# Altium schematic sheet cc2538.SchDoc: Edison Gateway - CC2538
size Letter; Author: Ye-Sheng Kuo; DocumentNumber: 8; Revision: 3; SheetNumber: 8; SheetTotal: 10
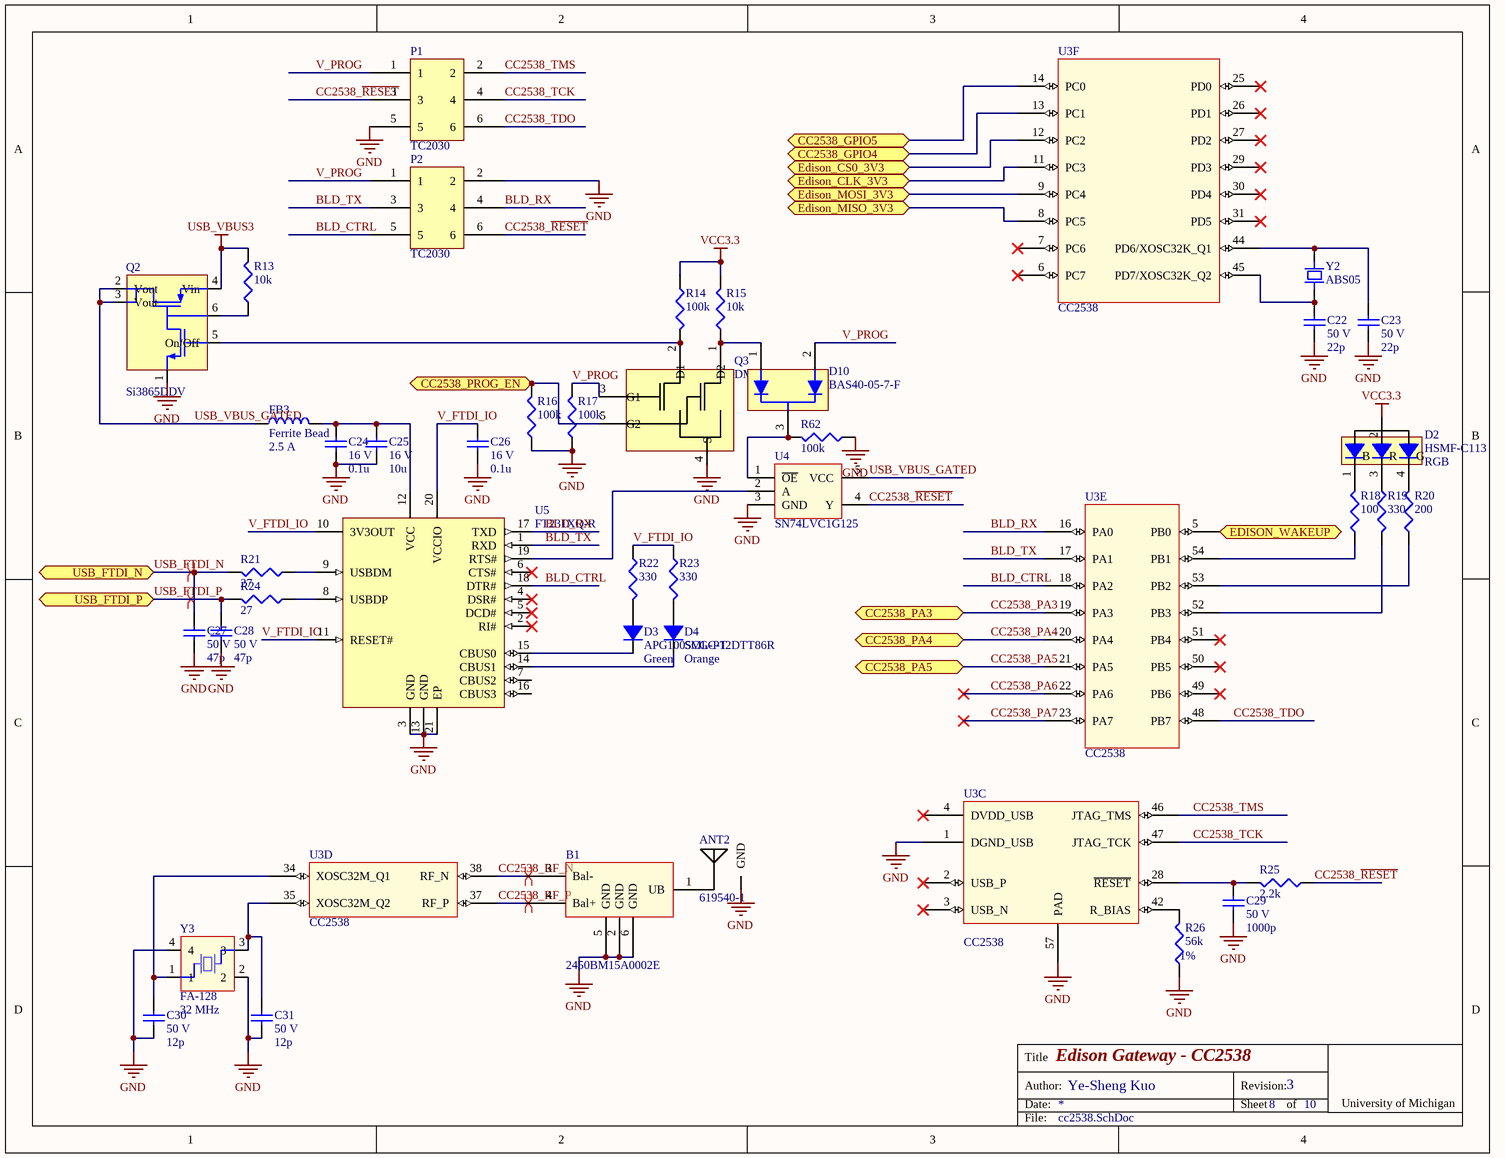
[diagram p0: cc2538.SchDoc]

## Parts
ANT2  619540-1  [619540-1]
B1  2450BM15A0002E  [2450BM15A0002]
C22  voltage rated: 50 V  [0402]  (hidden comment: 22p)
C23  voltage rated: 50 V  [0402]  (hidden comment: 22p)
C24  voltage rated: 16 V  [0402]  (hidden comment: 0.1u)
C25  voltage rated: 16 V  [0603]  (hidden comment: 10u)
C26  voltage rated: 16 V  [0402]  (hidden comment: 0.1u)
C27  voltage rated: 50 V  [0402]  (hidden comment: 47p)
C28  voltage rated: 50 V  [0402]  (hidden comment: 47p)
C29  voltage rated: 50 V  [0402]  (hidden comment: 1000p)
C30  voltage rated: 50 V  [0402]  (hidden comment: 12p)
C31  voltage rated: 50 V  [0402]  (hidden comment: 12p)
D2  HSMF-C113  value RGB  [HSMF]
D3  APG1005CGC-T  value Green  [0402 - LED]
D4  SML-P12DTT86R  value Orange  [0402 - LED]
D10  BAS40-05-7-F  [SOT23-3]
FB3  Ferrite Bead  Current Rating (Max): 2.5 A  [0603]
P1  TC2030  [TC2030-IDC-NLFP]
P2  TC2030  [TC2030-IDC-NLFP]
Q2  Si3865DDV  [TSOT-23]
Q3  DMN32D2LDF  [SOT-353-5]
R13  10k  [0402]
R14  100k  [0402]
R15  10k  [0402]
R16  100k  [0402]
R17  100k  [0402]
R18  100  [0402]
R19  330  [0402]
R20  200  [0402]
R21  27  [0402]
R22  330  [0402]
R23  330  [0402]
R24  27  [0402]
R25  2.2k  [0402]
R26  Tolerance: 1%  [0402]  (hidden comment: 56k)
R62  100k  [0402]
U3  CC2538  [QFN56]  (parts C,D,E,F of 6)
U4  SN74LVC1G125  [SOT23-5]
U5  FT231XQ-R  [QFN-20_N]
Y2  ABS05  [ABS05]
Y3  FA-128  frequency: 32 MHz  [FA-128]

## Ports
CC2538_GPIO4, CC2538_GPIO5, CC2538_PA3, CC2538_PA4, CC2538_PA5, CC2538_PROG_EN, Edison_CLK_3V3, Edison_CS0_3V3, Edison_MISO_3V3, Edison_MOSI_3V3, EDISON_WAKEUP, USB_FTDI_N, USB_FTDI_P

## Nets
GND: ANT2.1(GND) B1.2(GND) B1.5(GND) B1.6(GND) C22.2 C23.2 C24.2 C25.2 C26.2 C27.1 C28.1 C29.2 C30.1 C31.1 P1.5 P2.2 Q2.1 Q3.4(S) R16.2 R17.2 R26.2 R62.2 U3.1(DGND_USB) U3.57(PAD) U4.3(GND) U5.3(GND) U5.13(GND) U5.21(EP) Y3.2 Y3.4
USB_VBUS3: Q2.4(Vin) R13.1
VCC3.3: D2.2 R14.1 R15.1
BLD_CTRL: P2.5 U3.18(PA2) U5.18(DTR#)
BLD_RX: P2.4 U3.16(PA0) U5.17(TXD)
BLD_TX: P2.3 U3.17(PA1) U5.1(RXD)
CC2538_GPIO4: U3.13(PC1) ; port CC2538_GPIO4
CC2538_GPIO5: U3.14(PC0) ; port CC2538_GPIO5
CC2538_PA3: U3.19(PA3) ; port CC2538_PA3
CC2538_PA4: U3.20(PA4) ; port CC2538_PA4
CC2538_PA5: U3.21(PA5) ; port CC2538_PA5
CC2538_PA6: U3.22(PA6)
CC2538_PA7: U3.23(PA7)
CC2538_PROG_EN: Q3.5(G2) R16.1 ; port CC2538_PROG_EN
CC2538_~{RESET}: P1.3 P2.6 R25.2 U4.4(Y)
CC2538_RF_N: B1.3(Bal-) U3.38(RF_N)
CC2538_RF_P: B1.4(Bal+) U3.37(RF_P)
CC2538_TCK: P1.4 U3.47(JTAG_TCK)
CC2538_TDO: P1.6 U3.48(PB7)
CC2538_TMS: P1.2 U3.46(JTAG_TMS)
Edison_CLK_3V3: U3.11(PC3) ; port Edison_CLK_3V3
Edison_CS0_3V3: U3.12(PC2) ; port Edison_CS0_3V3
Edison_MISO_3V3: U3.8(PC5) ; port Edison_MISO_3V3
Edison_MOSI_3V3: U3.9(PC4) ; port Edison_MOSI_3V3
EDISON_WAKEUP: U3.5(PB0) ; port EDISON_WAKEUP
USB_FTDI_N: C27.2 R21.1 ; port USB_FTDI_N
USB_FTDI_P: C28.2 R24.1 ; port USB_FTDI_P
USB_VBUS_GATED: FB3.2 Q2.2(Vout) Q2.3(Vout) U4.5(VCC)
V_FTDI_IO: C26.1 R22.2 R23.2 U5.10(3V3OUT) U5.11(RESET#) U5.20(VCCIO)
V_PROG: D10.2 P1.1 P2.1 Q3.3(G1) R17.1
NetANT2_2: ANT2.2 B1.1(UB)
NetC22_1: C22.1 U3.45(PD7/XOSC32K_Q2) Y2.2
NetC23_1: C23.1 U3.44(PD6/XOSC32K_Q1) Y2.1
NetC24_1: C24.1 C25.1 FB3.1 U5.12(VCC)
NetC29_1: C29.1 R25.1 U3.28(~{RESET})
NetC30_2: C30.2 U3.34(XOSC32M_Q1) Y3.1
NetC31_2: C31.2 U3.35(XOSC32M_Q2) Y3.3
NetD2_1: D2.1 R18.1
NetD2_3: D2.3 R19.2
NetD2_4: D2.4 R20.1
NetD3_1: D3.1 R22.1
NetD3_2: D3.2 U5.15(CBUS0)
NetD4_1: D4.1 R23.1
NetD4_2: D4.2 U5.14(CBUS1)
NetD10_1: D10.1 Q3.1(D2) R15.2
NetD10_3: D10.3 R62.1 U4.1(~{OE})
NetQ2_5: Q2.5(On/Off) Q3.2(D1) R14.2
NetQ2_6: Q2.6 R13.2
NetR18_2: R18.2 U3.54(PB1)
NetR19_1: R19.1 U3.52(PB3)
NetR20_2: R20.2 U3.53(PB2)
NetR21_2: R21.2 U5.9(USBDM)
NetR24_2: R24.2 U5.8(USBDP)
NetR26_1: R26.1 U3.42(R_BIAS)
NetU4_2: U4.2(A) U5.19(RTS#)

Not connected (* = marked no-connect by the designer): U3 2(USB_P)* 3(USB_N)* 4(DVDD_USB)* 6(PC7)* 7(PC6)* 25(PD0)* 26(PD1)* 27(PD2)* 29(PD3)* 30(PD4)* 31(PD5)* 49(PB6)* 50(PB5)* 51(PB4)*; U5 2(RI#)* 4(DSR#)* 5(DCD#)* 6(CTS#)* 7(CBUS2) 16(CBUS3)

## Layout directives
differential pair: CC2538_RF_N, CC2538_RF_P, USB_FTDI_N, USB_FTDI_P

## Notes on the sheet
- Title
- Date:
- Author:
- Revision:
- Sheet
- of
- University of Michigan
- File:
- (in symbol HSMF-C113) B; R; G

## Library data of the parts
ANT2 = 619540-1: CONN SMA JACK; Supplier 1: Digi-Key; Supplier Part Number 1: A120734-ND
B1 = 2450BM15A0002E: 2.45 GHz Balun for TI CC253X; Supplier 1: Digi-Key; Supplier Part Number 1: 712-1536-1-ND
C22 C23 = 500R07S220GV4T: 22pF ±2% 50V Ceramic Capacitor C0G, NP0 0402; Manufacture: Johanson Technology Inc.; Note: RF application; tolerance: 2%; package: 0402; Supplier 1: Digi-Key; Supplier Part Number 1: 712-1274-1-ND; Value: 22p; Temperature Coefficient: C0G, NP0; Manufacturer Part Number: 500R07S220GV4T
C24 C26 = GRM155R71C104KA88D: 0.10µF ±10% 16V Ceramic Capacitor X7R 0402; Manufacture: Murata; tolerance: 10%; package: 0402; Supplier 1: Digi-Key; Supplier Part Number 1: 490-3261-1-ND; Value: 0.1u; Temperature Coefficient: X7R; Manufacturer Part Number: GRM155R71C104KA88D
C25 = GRM188C81C106MA73D: 10µF ±20% 16V Ceramic Capacitor X6S 0603; Manufacture: Murata; tolerance: 20%; package: 0603; Temperature Coefficient: X6S; Supplier 1: Digi-Key; Supplier Part Number 1: 490-7198-1-ND; Value: 10u; Manufacturer Part Number: GRM188C81C106MA73D
C27 C28 = 500R07N470JV4T: 47pF ±5% 50V Ceramic Capacitor C0G, NP0 0402; Manufacture: Johanson Dielectrics Inc.; tolerance: 5%; package: 0402; Supplier 1: Digi-Key; Supplier Part Number 1: 709-1121-1-ND; Value: 47p; Temperature Coefficient: C0G, NP0; Manufacturer Part Number: 500R07N470JV4T
C29 = C1005C0G1H102J050BA: 1000pF ±5% 50V Ceramic Capacitor C0G, NP0 0402; Manufacture: TDK; tolerance: 5%; package: 0402; Supplier 1: Digi-Key; Supplier Part Number 1: 445-6846-1-ND; Value: 1000p; Temperature Coefficient: C0G, NP0; Manufacturer Part Number: C1005C0G1H102J050BA
C30 C31 = 500R07S120GV4T: 12pF ±2% 50V Ceramic Capacitor C0G, NP0 0402; Manufacture: Johanson Technology Inc.; Note: RF application; tolerance: 2%; package: 0402; Supplier 1: Digi-Key; Supplier Part Number 1: 712-1256-1-ND; Value: 12p; Temperature Coefficient: C0G, NP0; Manufacturer Part Number: 500R07S120GV4T
D2 = HSMF-C113: Red, Green, Blue (RGB) 626nm Red, 572nm Green, 470nm Blue LED Indication - Discrete 1.9V Red, 2V Green, 3.4V Blue 4-SMD; Manufacturer: Broadcom Limited; Supplier 1: Digi-Key; Supplier Part Number 1: 516-2232-1-ND; Manufacturer Part Number: HSMF-C113; Wavelength: 626nm Red, 572nm Green, 470nm Blue
D3 = APG1005CGC-T: Green 571nm LED Indication - Discrete 2V 0402 (1005 Metric); Manufacturer: Kingbright; Current @ VF: 20 mA; package: 0402; Forward Voltage: 2 V; Manufacturer Part Number: APG1005CGC-T; Wavelength: 571 nm; Supplier 1: Digi-Key; Supplier Part Number 1: 754-1811-1-ND
D4 = SML-P12DTT86R: Orange 605nm LED Indication - Discrete 2.1V 0402; Manufacturer: Rohm Semiconductor; Current @ VF: 20 mA; Supplier 1: Digi-Key; Supplier Part Number 1: 846-1200-1-ND; package: 0402; Forward Voltage: 2.1 V; Manufacturer Part Number: SML-P12DTT86R; Wavelength: 605 nm
D10 = BAS40-05-7-F: Diode Array 1Pair Common Cathode Schottky 40V 200mA (DC) Surface Mount TO-236-3, SC-59, SOT-23-3; Manufacturer: Diodes Incorporated; Forward Voltage @ If: 1 V @ 40 mA; Manufacturer Part Number: BAS40-05-7-F; current: 200 mA; reverse voltage: 40 V; diode type: Schottky; Supplier 1: Digi-Key; Supplier Part Number 1: BAS40-05FDICT-ND
FB3 = BLM18SG221TN1D: FERRITE BEAD 220 OHM 0603; Manufacturer: Murata; DC resistance: 40m; Impedance @ Frequency: 220 Ohm @ 100MHz; package: 0603; Supplier 1: Digi-Key; Supplier Part Number 1: 490-5225-1-ND; Manufacturer Part Number: BLM18SG221TN1D
P1 P2 = TC2030: TC2030-MCP-NL; Note: Not a part
Q2 = Si3865DDV: Load Switch; Supplier 1: Digi-Key; Supplier Part Number 1: SI3865DDV-T1-GE3CT-ND
Q3 = DMN32D2LDF: Common Source Dual N-Channel MOSFET; Supplier 1: Digi-Key; Supplier Part Number 1: DMN32D2LDF-7DICT-ND
R13 R15 = CRCW040210K0FKED: RES SMD 10K OHM 1% 1/16W 0402; Manufacturer: Vishay Dale; Temperature Coefficient: 100 ppm/C; Tolerance: 1%; Power: 1/16 W; package: 0402; Supplier 1: Digi-Key; Supplier Part Number 1: 541-10.0KLCT-ND; value: 10k; Manufacturer Part Number: CRCW040210K0FKED
R14 R16 R17 R62 = CRCW0402100KFKED: RES SMD 100K OHM 1% 1/16W 0402; Manufacturer: Vishay Dale; Temperature Coefficient: 100 ppm/C; Tolerance: 1%; Power: 1/16 W; Supplier 1: Digi-Key; Supplier Part Number 1: 541-100KLCT-ND; package: 0402; value: 100k; Manufacturer Part Number: CRCW0402100KFKED
R18 = CRCW0402100RFKED: RES SMD 100 OHM 1% 1/16W 0402; Manufacturer: Vishay Dale; Temperature Coefficient: 100 ppm/C; Tolerance: 1%; Power: 1/16 W; package: 0402; Supplier 1: Digi-Key; Supplier Part Number 1: 541-100LCT-ND; value: 100; Manufacturer Part Number: CRCW0402100RFKED
R19 R22 R23 = CRCW0402330RFKED: RES SMD 330 OHM 1% 1/16W 0402; Manufacturer: Vishay Dale; Temperature Coefficient: 100 ppm/C; Tolerance: 1%; Power: 1/16 W; package: 0402; Supplier 1: Digi-Key; Supplier Part Number 1: 541-330LCT-ND; value: 330; Manufacturer Part Number: CRCW0402330RFKED
R20 = CRCW0402200RFKED: RES SMD 200 OHM 1% 1/16W 0402; Manufacturer: Vishay Dale; Temperature Coefficient: 100 ppm/C; Tolerance: 1%; Power: 1/16 W; package: 0402; Supplier 1: Digi-Key; Supplier Part Number 1: 541-200LCT-ND; value: 200; Manufacturer Part Number: CRCW0402200RFKED
R21 R24 = CRCW040227R0FKED: RES SMD 27 OHM 1% 1/16W 0402; Manufacturer: Vishay Dale; Temperature Coefficient: 100 ppm/C; Tolerance: 1%; Power: 1/16 W; package: 0402; Supplier 1: Digi-Key; Supplier Part Number 1: 541-27.0LCT-ND; value: 27; Manufacturer Part Number: CRCW040227R0FKED
R25 = CRCW04022K20FKED: RES SMD 2.2K OHM 1% 1/16W 0402; Manufacturer: Vishay Dale; Temperature Coefficient: 100 ppm/C; Tolerance: 1%; Power: 1/16 W; package: 0402; Supplier 1: Digi-Key; Supplier Part Number 1: 541-2.20KLCT-ND; value: 2.2k; Manufacturer Part Number: CRCW04022K20FKED
R26 = CRCW040256K0FKED: RES SMD 56K OHM 1% 1/16W 0402; Manufacturer: Vishay Dale; Temperature Coefficient: 100 ppm/C; Power: 1/16 W; package: 0402; Supplier 1: Digi-Key; Supplier Part Number 1: 541-56.0KLCT-ND; value: 56k; Manufacturer Part Number: CRCW040256K0FKED
U3 = CC2538: A Powerful System-On-Chip for 2.4-GHz IEEE 802.15.4, 6LoWPAN  and ZigBee Applications; Supplier 1: Digi-Key; Supplier Part Number 1: 296-35797-1-ND
U4 = SN74LVC1G125: Single Bus Buffer Gate With 3-State Output; Supplier 1: Digi-Key; Supplier Part Number 1: 296-11603-1-ND
U5 = FT231XQ-R: USB to Full-Handshake UART Interface Chip, UHCI/OHCI/EHCI Compatible, USB 2.0 Compatible, -40 to +85 degC, 20-Pin QFN, Pb-Free, Tape and Reel; Manufacturer: FTDI; DatasheetVersion: ver 1.2, Feb-2013; PackageVersion: Feb-13; PackageReference: QFN-20; PackageDescription: 20-Pin Quad Flat No-Lead, 4 x 4 mm Body, 0.5 mm Pitch; Code_JEDEC: MO-220WGGD-1; PartNumber: FT231XQ-R; ComponentLink1Description: Manufacturer URL; ComponentLink1URL: http://www.ftdichip.com/; ComponentLink2Description: Datasheet; ComponentLink2URL: http://www.ftdichip.com/Support/Documents/DataSheets/ICs/DS_FT231X.pdf; ComponentLink3Description: FT231X Product Page; ComponentLink3URL: www.ftdichip.com/Products/ICs/FT231X.html; Supplier 1: Digi-Key; Supplier Part Number 1: 768-1155-ND
Y2 = ABS05: 32768 Hz SMD Low profile crystal; Supplier 1: Digi-Key; Supplier Part Number 1: 535-11899-1-ND
Y3 = FA-128: MHz Range Crystal Unit; Load capatance: 10 pF; ESR: 60; stability: 20 ppm; Supplier 1: Digi-Key; Supplier Part Number 1: SER4079CT-ND